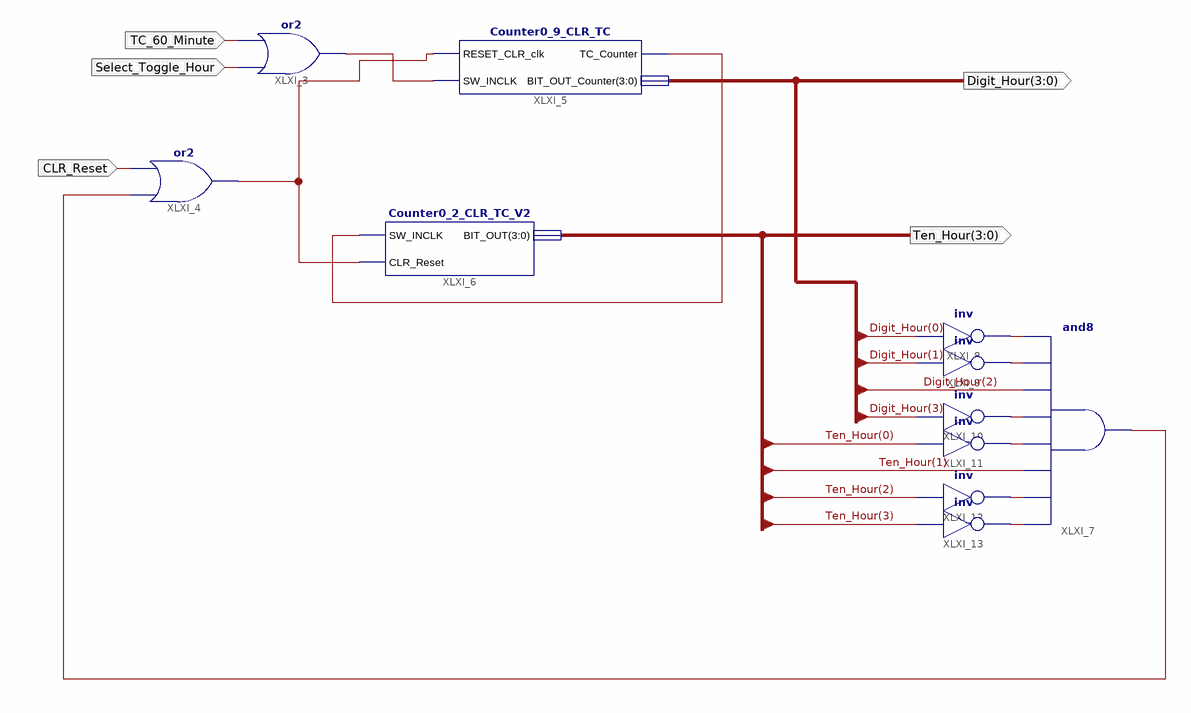
[diagram p0: schematic sheet 1]
// Xilinx ISE schematic Time_23_Hour.sch (spartan6) as structural Verilog: 11 symbols, 5 ports
module Time_23_Hour (
  input  TC_60_Minute,
  input  Select_Toggle_Hour,
  input  CLR_Reset,
  output [3:0] Ten_Hour,
  output [3:0] Digit_Hour
);

  wire XLXN_9, XLXN_26, XLXN_37, XLXN_38, XLXN_39, XLXN_40, XLXN_41, XLXN_42, XLXN_43, XLXN_60;

  or XLXI_3 (XLXN_9, Select_Toggle_Hour, TC_60_Minute);
  or XLXI_4 (XLXN_26, XLXN_60, CLR_Reset);
  Counter0_9_CLR_TC XLXI_5 (
    .BIT_OUT_Counter(Digit_Hour), .RESET_CLR_clk(XLXN_26), .SW_INCLK(XLXN_9), .TC_Counter(XLXN_37));
  Counter0_2_CLR_TC_V2 XLXI_6 (.BIT_OUT(Ten_Hour), .CLR_Reset(XLXN_26), .SW_INCLK(XLXN_37));
  and XLXI_7 (XLXN_60, XLXN_43, XLXN_42, Ten_Hour[1], XLXN_41, XLXN_40, Digit_Hour[2], XLXN_39, XLXN_38);
  not XLXI_8 (XLXN_38, Digit_Hour[0]);
  not XLXI_9 (XLXN_39, Digit_Hour[1]);
  not XLXI_10 (XLXN_40, Digit_Hour[3]);
  not XLXI_11 (XLXN_41, Ten_Hour[0]);
  not XLXI_12 (XLXN_42, Ten_Hour[2]);
  not XLXI_13 (XLXN_43, Ten_Hour[3]);
endmodule
